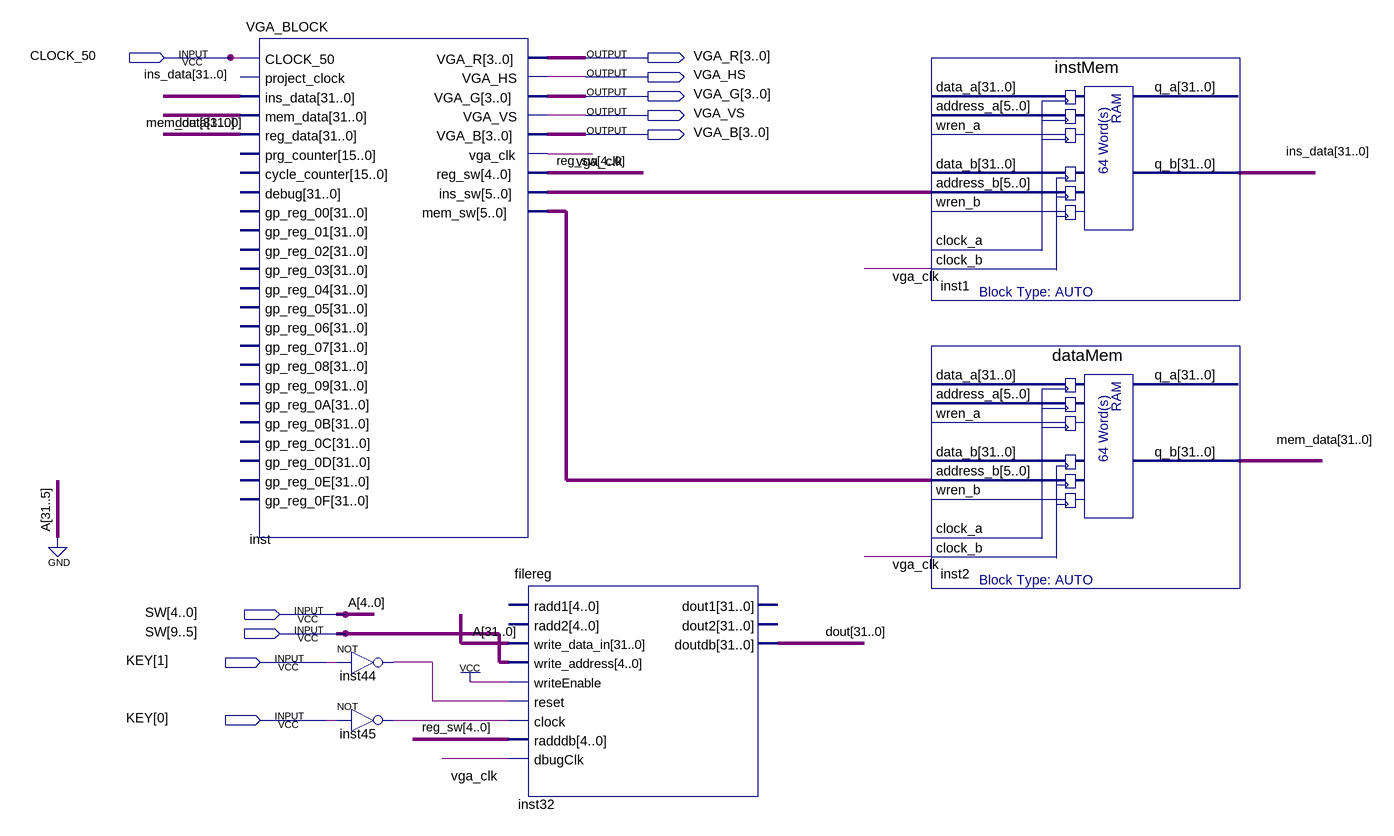
[diagram p0: schematic sheet]
// Quartus schematic Lab4.bdf as structural Verilog: 6 symbols, 10 pins
module Lab4 (
  input  CLOCK_50,
  input  [9:0] SW,
  input  [1:0] KEY,
  output [3:0] VGA_R,
  output VGA_HS,
  output [3:0] VGA_G,
  output VGA_VS,
  output [3:0] VGA_B
);

  wire inst44_out, inst45_out, vga_clk;
  wire [4:0] reg_sw;
  wire [5:0] inst_ins_sw, inst_mem_sw;
  wire [31:0] dout, ins_data, mem_data;

  VGA_BLOCK inst (
    .CLOCK_50(CLOCK_50), .ins_data(ins_data), .mem_data(mem_data), .reg_data(dout), .VGA_R(VGA_R),
    .VGA_HS(VGA_HS), .VGA_G(VGA_G), .VGA_VS(VGA_VS), .VGA_B(VGA_B), .vga_clk(vga_clk), .reg_sw(reg_sw),
    .ins_sw(inst_ins_sw), .mem_sw(inst_mem_sw));  // open: project_clock, prg_counter, cycle_counter, debug, gp_reg_00, gp_reg_01, gp_reg_02, gp_reg_03, gp_reg_04, gp_reg_05, gp_reg_06, gp_reg_07, gp_reg_08, gp_reg_09, gp_reg_0A, gp_reg_0B, gp_reg_0C, gp_reg_0D, gp_reg_0E, gp_reg_0F
  not inst44 (inst44_out, KEY[1]);
  not inst45 (inst45_out, KEY[0]);
  filereg inst32 (
    .write_data_in({{27{1'b0}}, SW[4:0]}), .write_address(SW[9:5]), .writeEnable(1'b1), .reset(inst44_out),
    .clock(inst45_out), .radddb(reg_sw), .dbugClk(vga_clk), .doutdb(dout));  // open: radd1, radd2, dout1, dout2
  instMem inst1 (
    .address_b(inst_ins_sw), .clock_b(vga_clk), .q_b(ins_data));  // open: data_a, address_a, wren_a, data_b, wren_b, clock_a, q_a
  dataMem inst2 (
    .address_b(inst_mem_sw), .clock_b(vga_clk), .q_b(mem_data));  // open: data_a, address_a, wren_a, data_b, wren_b, clock_a, q_a

  // Other names for the same wires on the sheet: A[4:0] = SW[4:0]
endmodule
